# Altium schematic sheet OTHER.SchDoc
size A4; SheetNumber: 2; SheetTotal: 2
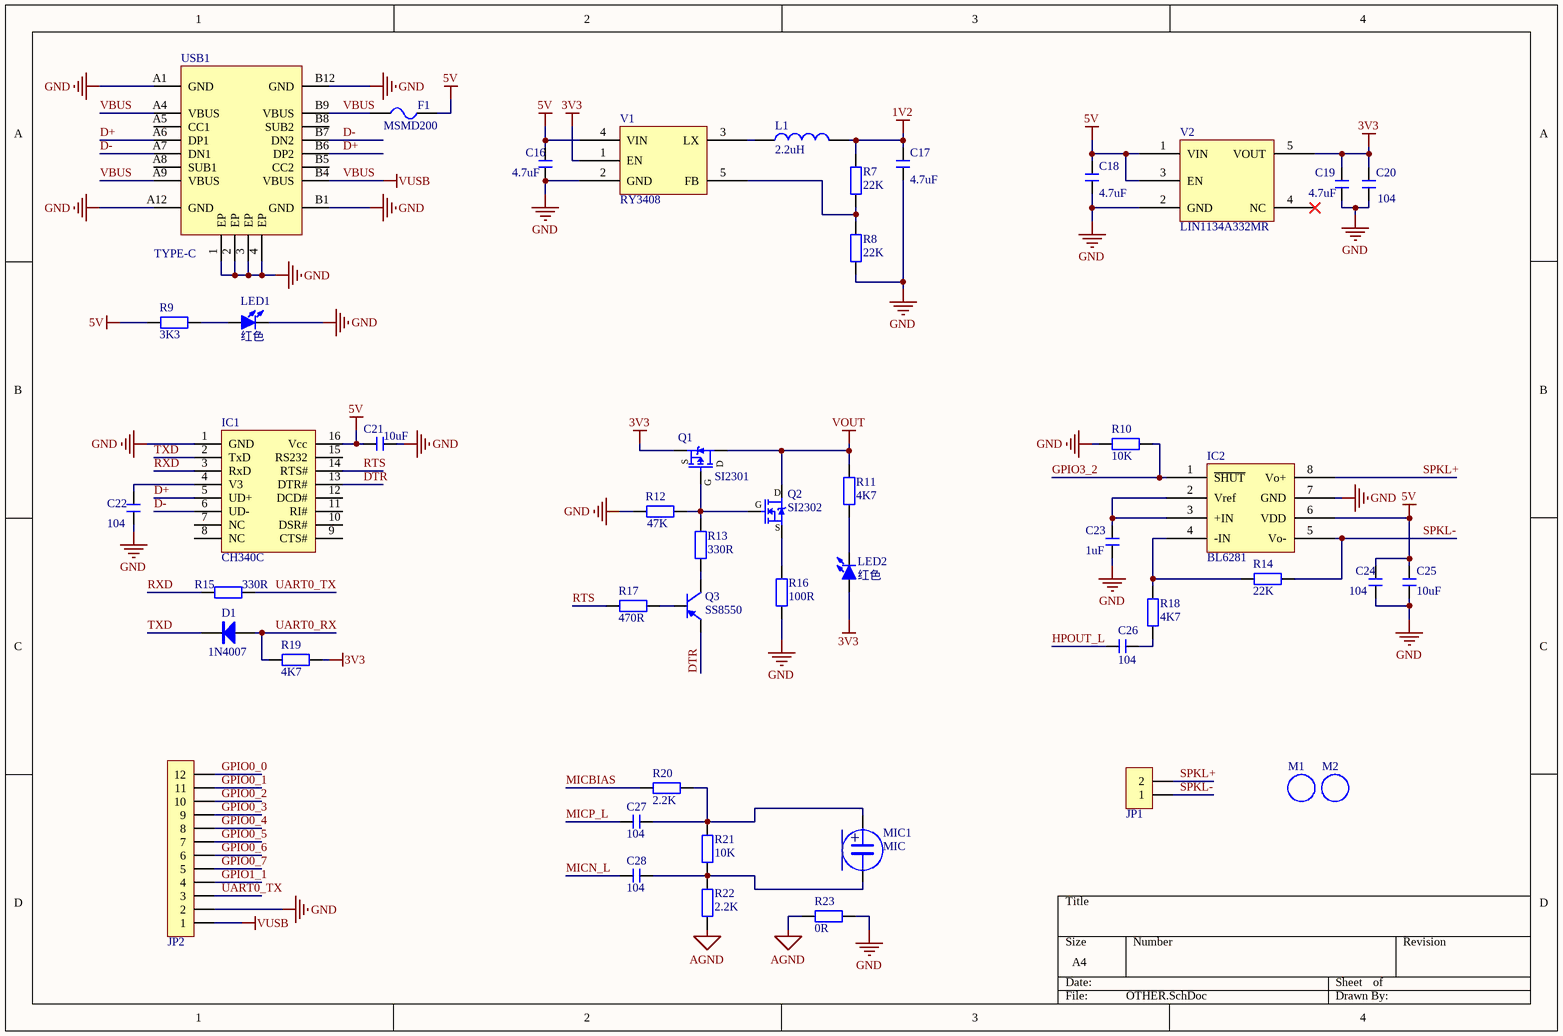
[diagram p0: OTHER.SchDoc]

## Parts
C16  4.7uF  [C 0603_L]
C17  4.7uF  [C 0603_L]
C18  4.7uF  [C 0603_L]
C19  4.7uF  [C 0603_L]
C20  104  [C 0603_L]
C21  10uF  [C 0805_L]
C22  104  [C 0603_L]
C23  1uF  [C 0603_L]
C24  104  [C 0603_L]
C25  10uF  [C 0603_L]
C26  104  [C 0603_L]
C27  104  [C 0603_L]
C28  104  [C 0603_L]
D1  1N4007  [SOD-123]
F1  MSMD200  [FU 0805]
IC1  CH340C  [SOP16_L]
IC2  BL6281  [SOP8_L]
JP1  HDR-1X2  [PH2.0-WS-2P]  (value not drawn)
JP2  HDR-1X12  [HDR2.54-LI-12P]  (value not drawn)
L1  2.2uH  [L 0805]
LED1  红色  [LED 0603R]
LED2  红色  [LED 0603R]
M1  (no value)  [M3 125X200]
M2  (no value)  [M3 125X200]
MIC1  MIC  [MIC-6*2.7]
Q1  SI2301  [SOT23-3N]
Q2  SI2302  [SOT23-3N]
Q3  SS8550  [SOT23-3N]
R7  22K  [R 0603_L]
R8  22K  [R 0603_L]
R9  3K3  [R 0603_L]
R10  10K  [R 0603_L]
R11  4K7  [R 0603_L]
R12  47K  [R 0603_L]
R13  330R  [R 0603_L]
R14  22K  [R 0603_L]
R15  330R  [R 0603_L]
R16  100R  [R 0603_L]
R17  470R  [R 0603_L]
R18  4K7  [R 0603_L]
R19  4K7  [R 0603_L]
R20  2.2K  [R 0603_L]
R21  10K  [R 0603_L]
R22  2.2K  [R 0603_L]
R23  0R  [R 0603_L]
USB1  TYPE-C  [TYPE-C_16P]
V1  RY3408  [SOT23-5N]
V2  LIN1134A332MR  [SOT23-5L]

## Nets
1V2: C17.2 L1.2 R7.2
3V3: C19.2 C20.2 LED2.1(A) Q1.2(S) R19.1 V1.1(EN) V2.5(VOUT)
5V: C16.2 C18.2 C21.2 C24.1 C25.2 F1.2 IC1.16(Vcc) IC2.6(VDD) R9.1 V1.4(VIN) V2.1(VIN) V2.3(EN)
AGND: R22.2 R23.1
GND: C16.1 C17.1 C18.1 C19.1 C20.1 C21.1 C22.1 C23.1 C24.2 C25.1 IC1.1(GND) IC2.7(GND) JP2.2 LED1.2(K) R8.1 R10.2 R12.2 R16.2 R23.2 USB1.1(EP) USB1.2(EP) USB1.3(EP) USB1.4(EP) USB1.A1(GND) USB1.A12(GND) USB1.B1(GND) USB1.B12(GND) V1.2(GND) V2.2(GND)
VBUS: F1.1 JP2.1 USB1.A4(VBUS) USB1.A9(VBUS) USB1.B4(VBUS) USB1.B9(VBUS)  [also labelled VUSB]
VOUT: Q1.3(D) Q2.3(D) R11.2
D+: IC1.5(UD+) USB1.A6(DP1) USB1.B6(DP2)
D-: IC1.6(UD-) USB1.A7(DN1) USB1.B7(DN2)
DTR: IC1.13(DTR#) Q3.2(E)
GPIO0_0: JP2.12
GPIO0_1: JP2.11
GPIO0_2: JP2.10
GPIO0_3: JP2.9
GPIO0_4: JP2.8
GPIO0_5: JP2.7
GPIO0_6: JP2.6
GPIO0_7: JP2.5
GPIO1_1: JP2.4
GPIO3_2: IC2.1(~{SHUT}) R10.1
HPOUT_L: C26.2
MICBIAS: R20.1
MICN_L: C28.1
MICP_L: C27.1
RTS: IC1.14(RTS#) R17.2
RXD: IC1.3(RxD) R15.1
SPKL+: IC2.8(Vo+) JP1.2
SPKL-: IC2.5(Vo-) JP1.1 R14.1
TXD: D1.2(K) IC1.2(TxD)
UART0_RX: D1.1(A) R19.2
UART0_TX: JP2.3 R15.2
NetC22_2: C22.2 IC1.4(V3)
NetC23_2: C23.2 IC2.2(Vref) IC2.3(+IN)
NetC26_1: C26.1 R18.2
NetC27_2: C27.2 MIC1.1 R20.2 R21.1
NetC28_2: C28.2 MIC1.2 R21.2 R22.1
NetIC2_4: IC2.4(-IN) R14.2 R18.1
NetL1_1: L1.1 V1.3(LX)
NetLED1_1: LED1.1(A) R9.2
NetLED2_2: LED2.2(K) R11.1
NetQ1_1: Q1.1(G) Q2.1(G) R12.1 R13.2
NetQ2_2: Q2.2(S) R16.1
NetQ3_1: Q3.1(B) R17.1
NetQ3_3: Q3.3(C) R13.1
NetR7_1: R7.1 R8.2 V1.5(FB)

Not connected (* = marked no-connect by the designer): IC1 7(NC) 8(NC) 9(CTS#) 10(DSR#) 11(RI#) 12(DCD#) 15(RS232); USB1 A5(CC1) A8(SUB1) B5(CC2) B8(SUB2); V2 4(NC)*

## Notes on the sheet
- (in symbol MIC3) +

## Library data of the parts
C16-C28 = C: 无极性贴片电容; 版权归属: 源创客; BOM名称: 无极性贴片电容; 学习资源: www.ooocke.com
D1 = 1N4007: 整流二极管; 版权归属: 源创客; BOM名称: 整流二极管; 学习资源: www.ooocke.com
F1 = FU: 贴片保险丝; 版权归属: 源创客; BOM名称: 贴片保险丝; 学习资源: www.ooocke.com
IC1 = CH340G: 串口转USB; 版权归属: 源创客; BOM名称: 串口转USB; 学习资源: www.ooocke.com
IC2 = BL6281: 音频功放
JP1 = Header 2: 2P接插件; 版权归属: 源创客; BOM名称: 2P接插件; 学习资源: www.ooocke.com
JP2 = Header 12: 12P接插件; 版权归属: 源创客; BOM名称: 12P接插件; 学习资源: www.ooocke.com
L1 = L: 小功率贴片电感; 版权归属: 源创客; BOM名称: 小功率贴片电感; 学习资源: www.ooocke.com
LED1 LED2 = LED-SMD: 贴片LED; 版权归属: 源创客; BOM名称: 贴片LED; 学习资源: www.ooocke.com
M1 M2 = M3: 铜柱孔; 版权归属: 源创客; BOM名称: 铜柱孔; 学习资源: www.ooocke.com
MIC1 = MIC3: 麦克风
Q1 = SI2301: P沟道 20V/2.8A; BOM名称: 场效应管; 版权归属: 源创客; 学习资源: www.ooocke.com; 描述: P沟道 20V/2.8A
Q2 = SI2302: N沟道 20V/3A; BOM名称: 场效应管; 版权归属: 源创客; 学习资源: www.ooocke.com; 描述: N沟道 20V/3A
Q3 = 8550-SMD: 高频放大-PNP型; 版权归属: 源创客; 属性: 40V 1.5A 1W 100MHZ; BOM名称: 高频放大-PNP型; 学习资源: www.ooocke.com
R7-R23 = R: 贴片电阻; 版权归属: 源创客; BOM名称: 贴片电阻; 学习资源: www.ooocke.com
USB1 = TYPE-C_16P: 16脚TYPE-C母座
V1 = RY3408: DC电源芯片
V2 = LIN1134A332MR: DC稳压芯片